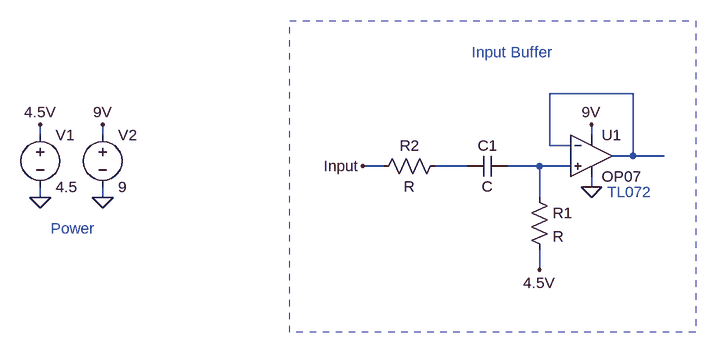
[diagram p0: schematic Chorus.asc]
Chorus.asc, the LTspice schematic file:
Version 4
SHEET 1 880 680
WIRE 272 48 144 48
WIRE -640 112 -640 96
WIRE -544 112 -544 96
WIRE 208 112 208 96
WIRE 144 128 144 48
WIRE 176 128 144 128
WIRE 272 144 272 48
WIRE 272 144 240 144
WIRE 320 144 272 144
WIRE -112 160 -144 160
WIRE 16 160 -32 160
WIRE 128 160 80 160
WIRE 176 160 128 160
WIRE 208 192 208 176
WIRE -640 208 -640 192
WIRE -544 208 -544 192
WIRE 128 208 128 160
WIRE 128 320 128 288
FLAG -640 208 0
FLAG -544 208 0
FLAG -640 96 4.5V
FLAG -544 96 9V
FLAG 208 192 0
FLAG 208 96 9V
FLAG 128 320 4.5V
FLAG -144 160 Input
SYMBOL OpAmps\\OP07 208 80 R0
SYMATTR InstName U1
SYMBOL voltage -640 96 R0
SYMATTR InstName V1
SYMATTR Value 4.5
SYMBOL voltage -544 96 R0
SYMATTR InstName V2
SYMATTR Value 9
SYMBOL res 112 192 R0
SYMATTR InstName R1
SYMBOL cap 80 144 R90
WINDOW 0 0 32 VBottom 2
WINDOW 3 32 32 VTop 2
SYMATTR InstName C1
SYMBOL res -16 144 R90
WINDOW 0 0 56 VBottom 2
WINDOW 3 32 56 VTop 2
SYMATTR InstName R2
TEXT 232 200 Left 2 ;TL072
TEXT -624 256 Left 2 ;Power
TEXT 24 -16 Left 2 ;Input Buffer
RECTANGLE Normal 368 416 -256 -64 2

The netlist it stands for:
* Chorus.asc
XU1 N003 N001 9V 0 N001 LT1001  ; OP07, pins In+ In- V+ V- OUT
V1 4.5V 0 4.5
V2 9V 0 9
R1 N003 4.5V R
C1 N003 N002 C
R2 N002 Input R
* TL072
* Power
* Input Buffer
.lib LTC.lib
.backanno
.end